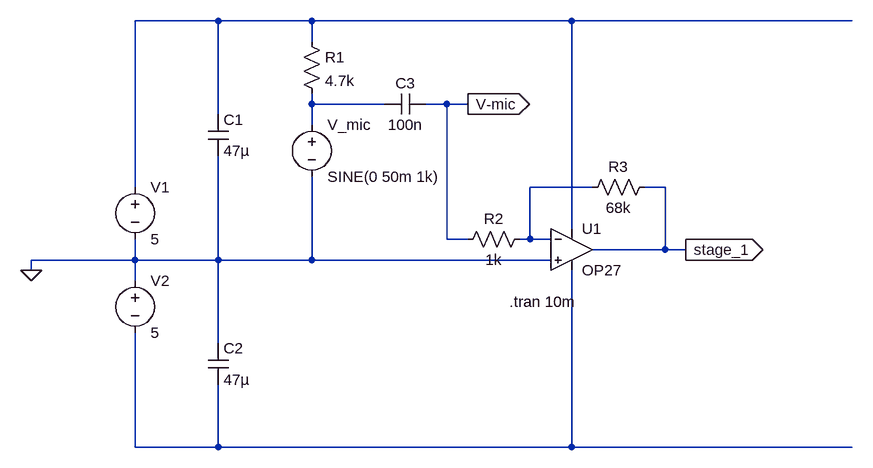
[diagram p0: schematic simulation_stage_3.asc]
simulation_stage_3.asc, the LTspice schematic file:
Version 4
SHEET 1 1060 680
WIRE 80 -144 -48 -144
WIRE 224 -144 80 -144
WIRE 624 -144 224 -144
WIRE 1056 -144 624 -144
WIRE 224 -112 224 -144
WIRE 224 -16 224 -32
WIRE 336 -16 224 -16
WIRE 432 -16 400 -16
WIRE 464 -16 432 -16
WIRE 80 0 80 -144
WIRE 224 16 224 -16
WIRE -48 112 -48 -144
WIRE 656 112 560 112
WIRE 768 112 736 112
WIRE 624 176 624 -144
WIRE 432 192 432 -16
WIRE 464 192 432 192
WIRE 560 192 560 112
WIRE 560 192 544 192
WIRE 592 192 560 192
WIRE 768 208 768 112
WIRE 768 208 656 208
WIRE 800 208 768 208
WIRE -48 224 -48 192
WIRE -48 224 -208 224
WIRE 80 224 80 64
WIRE 80 224 -48 224
WIRE 224 224 224 96
WIRE 224 224 80 224
WIRE 592 224 224 224
WIRE -208 240 -208 224
WIRE -48 256 -48 224
WIRE 80 352 80 224
WIRE -48 512 -48 336
WIRE 80 512 80 416
WIRE 80 512 -48 512
WIRE 624 512 624 240
WIRE 624 512 80 512
WIRE 1056 512 624 512
FLAG -208 240 0
FLAG 464 -16 V-mic
IOPIN 464 -16 Out
FLAG 800 208 stage_1
IOPIN 800 208 Out
SYMBOL voltage -48 96 R0
WINDOW 123 0 0 Left 0
WINDOW 39 0 0 Left 0
SYMATTR InstName V1
SYMATTR Value 5
SYMBOL voltage -48 240 R0
WINDOW 123 0 0 Left 0
WINDOW 39 0 0 Left 0
SYMATTR InstName V2
SYMATTR Value 5
SYMBOL cap 64 0 R0
SYMATTR InstName C1
SYMATTR Value 47µ
SYMBOL cap 64 352 R0
SYMATTR InstName C2
SYMATTR Value 47µ
SYMBOL voltage 224 0 R0
WINDOW 123 0 0 Left 0
WINDOW 39 0 0 Left 0
SYMATTR InstName V_mic
SYMATTR Value SINE(0 50m 1k)
SYMBOL res 208 -128 R0
SYMATTR InstName R1
SYMATTR Value 4.7k
SYMBOL cap 400 -32 R90
WINDOW 0 0 32 VBottom 2
WINDOW 3 32 32 VTop 2
SYMATTR InstName C3
SYMATTR Value 100n
SYMBOL OpAmps\\OP27 624 144 R0
SYMATTR InstName U1
SYMBOL res 560 176 R90
WINDOW 0 0 56 VBottom 2
WINDOW 3 32 56 VTop 2
SYMATTR InstName R2
SYMATTR Value 1k
SYMBOL res 752 96 R90
WINDOW 0 0 56 VBottom 2
WINDOW 3 32 56 VTop 2
SYMATTR InstName R3
SYMATTR Value 68k
TEXT 528 288 Left 2 !.tran 10m

The netlist it stands for:
* simulation_stage_3.asc
V1 N001 0 5
V2 0 N004 5
C1 N001 0 47µ
C2 0 N004 47µ
V_mic N002 0 SINE(0 50m 1k)
R1 N001 N002 4.7k
C3 V-mic N002 100n
XU1 0 N003 N001 N004 stage_1 OP27  ; pins In+ In- V+ V- OUT
R2 N003 V-mic 1k
R3 stage_1 N003 68k
.tran 10m
.lib ADI.lib
.backanno
.end